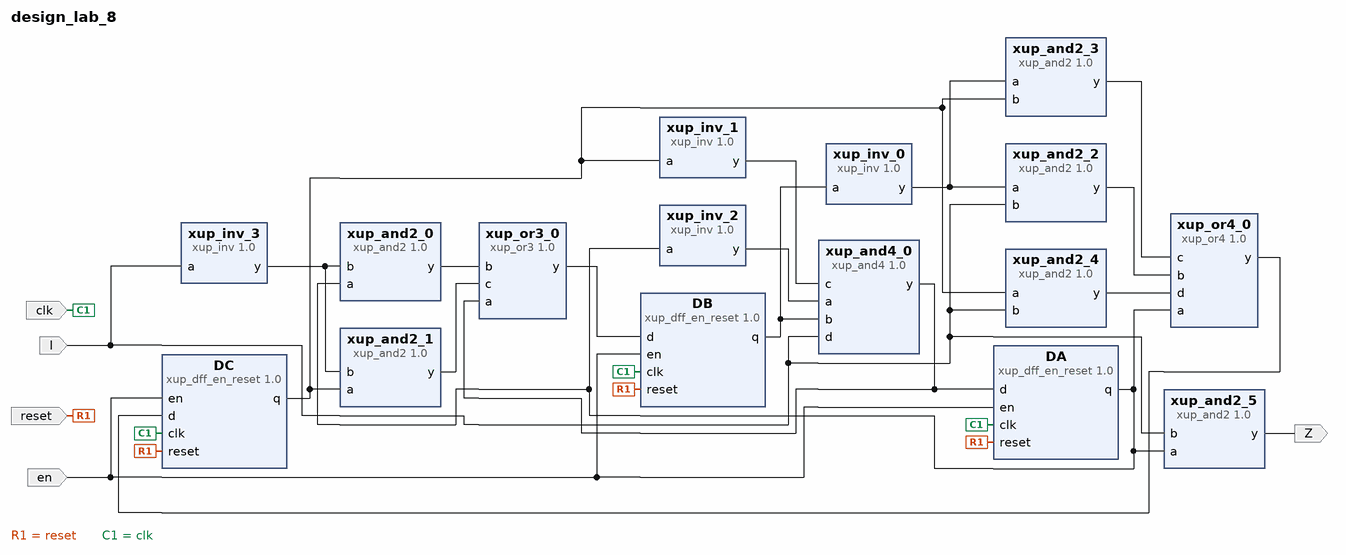
[diagram p0: block diagram of the top level]
# Vivado block design design_lab_8, xc7vx485tffg1157-1, Vivado 2019.2
create_bd_design design_lab_8

create_bd_port -dir I en
create_bd_port -dir I clk
create_bd_port -dir I reset
create_bd_port -dir I I
create_bd_port -dir O Z

create_bd_cell -type ip -vlnv xilinx.com:XUP:xup_dff_en_reset:1.0 DA
create_bd_cell -type ip -vlnv xilinx.com:XUP:xup_dff_en_reset:1.0 DB
create_bd_cell -type ip -vlnv xilinx.com:XUP:xup_dff_en_reset:1.0 DC
create_bd_cell -type ip -vlnv xilinx.com:XUP:xup_inv:1.0 xup_inv_0
create_bd_cell -type ip -vlnv xilinx.com:XUP:xup_inv:1.0 xup_inv_1
create_bd_cell -type ip -vlnv xilinx.com:XUP:xup_inv:1.0 xup_inv_2
create_bd_cell -type ip -vlnv xilinx.com:XUP:xup_inv:1.0 xup_inv_3
create_bd_cell -type ip -vlnv xilinx.com:XUP:xup_and4:1.0 xup_and4_0
create_bd_cell -type ip -vlnv xilinx.com:XUP:xup_and2:1.0 xup_and2_0
create_bd_cell -type ip -vlnv xilinx.com:XUP:xup_and2:1.0 xup_and2_1
create_bd_cell -type ip -vlnv xilinx.com:XUP:xup_or3:1.0 xup_or3_0
create_bd_cell -type ip -vlnv xilinx.com:XUP:xup_and2:1.0 xup_and2_2
create_bd_cell -type ip -vlnv xilinx.com:XUP:xup_and2:1.0 xup_and2_3
create_bd_cell -type ip -vlnv xilinx.com:XUP:xup_and2:1.0 xup_and2_4
create_bd_cell -type ip -vlnv xilinx.com:XUP:xup_or4:1.0 xup_or4_0
create_bd_cell -type ip -vlnv xilinx.com:XUP:xup_and2:1.0 xup_and2_5

# ---- connections ----

connect_bd_net [get_bd_pins DA/q] [get_bd_pins xup_inv_2/a] [get_bd_pins xup_and2_0/a] [get_bd_pins xup_or4_0/a] [get_bd_pins xup_and2_5/a]
connect_bd_net [get_bd_pins DB/q] [get_bd_pins xup_inv_0/a] [get_bd_pins xup_and4_0/b]
connect_bd_net [get_bd_pins DC/q] [get_bd_pins xup_inv_1/a] [get_bd_pins xup_and2_1/a] [get_bd_pins xup_and2_3/b] [get_bd_pins xup_and2_4/a]
connect_bd_net [get_bd_pins xup_inv_2/y] [get_bd_pins xup_and4_0/a]
connect_bd_net [get_bd_pins xup_inv_1/y] [get_bd_pins xup_and4_0/c]
connect_bd_net [get_bd_ports I] \
  [get_bd_pins xup_and4_0/d] [get_bd_pins xup_inv_3/a] [get_bd_pins xup_and2_2/b] [get_bd_pins xup_and2_4/b] \
  [get_bd_pins xup_and2_5/b]
connect_bd_net [get_bd_pins xup_and4_0/y] [get_bd_pins DA/d] [get_bd_pins xup_or3_0/a]
connect_bd_net [get_bd_pins xup_and2_0/y] [get_bd_pins xup_or3_0/b]
connect_bd_net [get_bd_pins xup_and2_1/y] [get_bd_pins xup_or3_0/c]
connect_bd_net [get_bd_pins xup_inv_3/y] [get_bd_pins xup_and2_0/b] [get_bd_pins xup_and2_1/b]
connect_bd_net [get_bd_pins xup_or3_0/y] [get_bd_pins DB/d]
connect_bd_net [get_bd_pins xup_inv_0/y] [get_bd_pins xup_and2_2/a] [get_bd_pins xup_and2_3/a]
connect_bd_net [get_bd_pins xup_and2_2/y] [get_bd_pins xup_or4_0/b]
connect_bd_net [get_bd_pins xup_and2_3/y] [get_bd_pins xup_or4_0/c]
connect_bd_net [get_bd_pins xup_and2_4/y] [get_bd_pins xup_or4_0/d]
connect_bd_net [get_bd_pins xup_or4_0/y] [get_bd_pins DC/d]
connect_bd_net [get_bd_pins xup_and2_5/y] [get_bd_ports Z]
connect_bd_net [get_bd_ports reset] [get_bd_pins DC/reset] [get_bd_pins DB/reset] [get_bd_pins DA/reset]
connect_bd_net [get_bd_ports clk] [get_bd_pins DA/clk] [get_bd_pins DB/clk] [get_bd_pins DC/clk]
connect_bd_net [get_bd_ports en] [get_bd_pins DA/en] [get_bd_pins DB/en] [get_bd_pins DC/en]

validate_bd_design
save_bd_design
